# EAGLE design spectrometer-teensy-mk-1.0.0 (EAGLE 6.6.0)
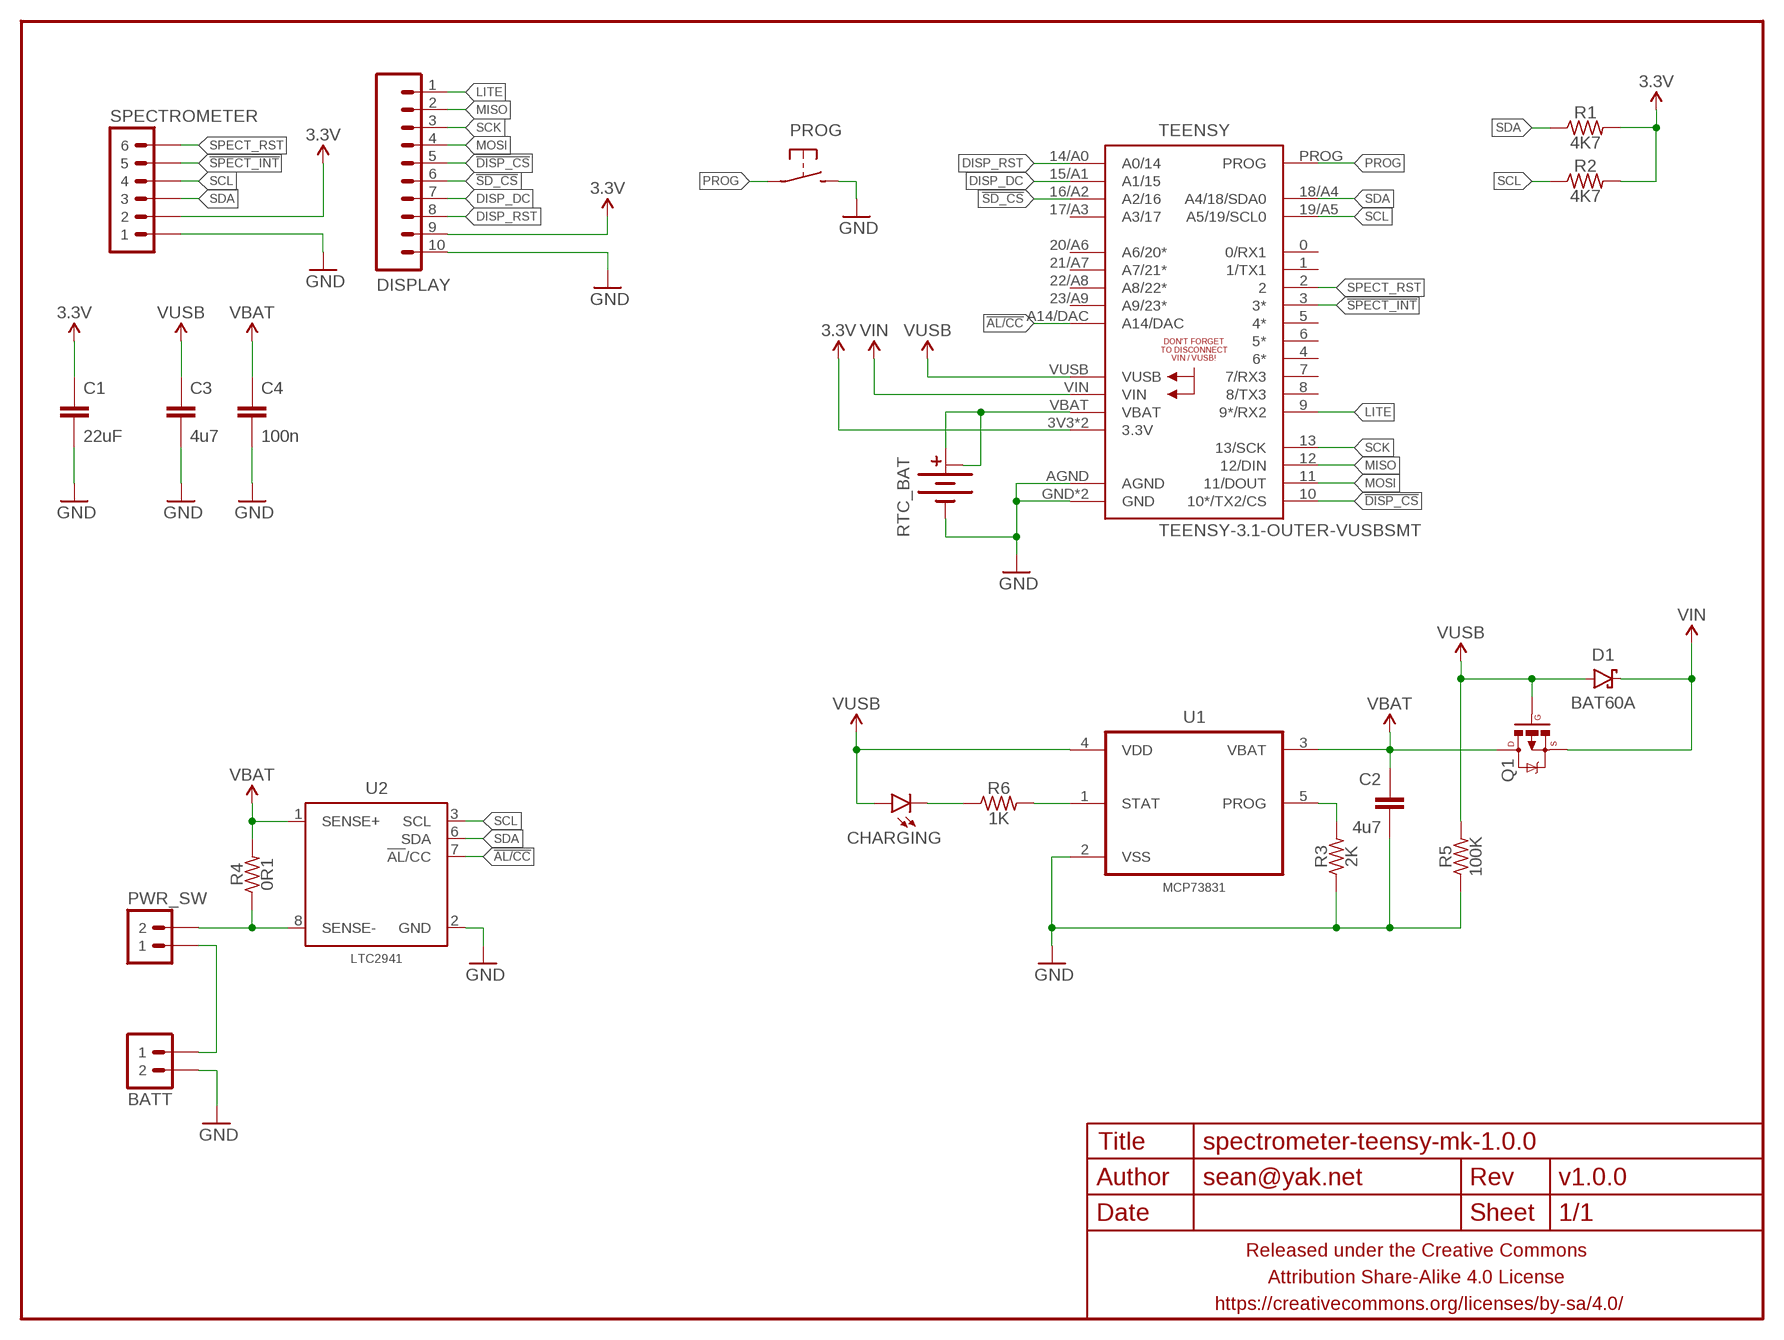
[diagram p0: schematic, sheet 1]

## Parts
BATT  M02JST-2MM-SMT  [JST-2-SMD]
C1  22uF  CAPACITOR-CERAMICC0805-TIGHTER  [C0805-TIGHTER]
C2  4u7  CAPACITOR-CERAMICC0603-TIGHTER  [C0603-TIGHTER]
C3  4u7  CAPACITOR-CERAMICC0603-TIGHTER  [C0603-TIGHTER]
C4  100n  CAPACITOR-CERAMICC0603-TIGHTER  [C0603-TIGHTER]
CHARGING  LED0603-TIGHT  [LED-0603-TIGHT]
D1  BAT60A  DIODE-SCHOTTKYSOD123  [SOD123-SCHOTTKY]
DISPLAY  M10SMD_RA_2MM  [1X10_SMD_RA_MALE]
FRAME1  FRAME-LETTERNO_PACKAGE  [DUMMY]
PROG  SPST-NO-TACTCK-PTS840-GK  [TACTILE-SMD-CK-PTS840-GK]
PWR_SW  M02JST-2MM-SMT  [JST-2-SMD]
Q1  MOSFET-PCHANNELSOT-23  [SOT23]
R1  4K7  RESISTORR0603-TIGHTER  [R0603-TIGHTER]
R2  4K7  RESISTORR0603-TIGHTER  [R0603-TIGHTER]
R3  2K  RESISTORR0603-TIGHTER  [R0603-TIGHTER]
R4  0R1  RESISTORR0603-TIGHTER  [R0603-TIGHTER]
R5  100K  RESISTORR0603-TIGHTER  [R0603-TIGHTER]
R6  1K  RESISTORR0603-TIGHTER  [R0603-TIGHTER]
RTC_BAT  BATTERY-COINCR1225_SMD_SMALLER  [BATTCON_12MM_SMD]
SPECTROMETER  M06SMD-2MM-RA  [1X06_SMD_RA_2MM]
TEENSY  TEENSY-3.1-OUTER-VUSBSMT  [TEENSY-3.1_SMT_BOTTOM_OUTERMOSTLY_VUSB]
U1  MCP73831  MCP73831T-2ACI/OT  [SOT95P280X145-5N]
U2  LTC2941  LTC2941MSOP-8  [MSOP-8]

## Nets
3.3V: C1.1 DISPLAY.9 R1.2 R2.2 SPECTROMETER.2 TEENSY.3V3(3.3V) TEENSY.3V3@1(3.3V)
!AL/CC: TEENSY.A14/DAC U2.7(!AL!/CC)
!DISP_CS: DISPLAY.5 TEENSY.10(10*/TX2/CS)
!SD_CS: DISPLAY.6 TEENSY.16/A2(A2/16)
!SPECT_INT: SPECTROMETER.5 TEENSY.3(3*)
DISP_DC: DISPLAY.7 TEENSY.15/A1(A1/15)
DISP_RST: DISPLAY.8 TEENSY.14/A0(A0/14)
GND: BATT.1 C1.2 C2.2 C3.2 C4.2 DISPLAY.10 PROG.3 PROG.4 R3.1 R5.1 RTC_BAT.- SPECTROMETER.1 TEENSY.AGND TEENSY.GND TEENSY.GND@1(GND) U1.2(VSS) U2.2(GND)
LITE: DISPLAY.1 TEENSY.9(9*/RX2)
MISO: DISPLAY.2 TEENSY.12(12/DIN)
MOSI: DISPLAY.4 TEENSY.11(11/DOUT)
N$1: R6.2 U1.1(STAT)
N$2: CHARGING.C R6.1
N$3: BATT.2 PWR_SW.2
N$4: R3.2 U1.5(PROG)
N$5: PWR_SW.1 R4.1 U2.8(SENSE-)
N$7: RTC_BAT.+@1(+) RTC_BAT.+@2(+1) TEENSY.VBAT
PROG: PROG.1 PROG.2 TEENSY.PROG
SCK: DISPLAY.3 TEENSY.13(13/SCK)
SCL: R2.1 SPECTROMETER.4 TEENSY.19/A5(A5/19/SCL0) U2.3(SCL)
SDA: R1.1 SPECTROMETER.3 TEENSY.18/A4(A4/18/SDA0) U2.6(SDA)
SPECT_RST: SPECTROMETER.6 TEENSY.2
VBAT: C2.1 C4.1 Q1.3(D) R4.2 U1.3(VBAT) U2.1(SENSE+)
VIN: D1.C Q1.2(S) TEENSY.VIN
VUSB: C3.1 CHARGING.A D1.A Q1.1(G) R5.2 TEENSY.VUSB U1.4(VDD)
Unconnected: TEENSY.0(0/RX1) TEENSY.1(1/TX1) TEENSY.4(6*) TEENSY.5(4*) TEENSY.6(5*) TEENSY.7(7/RX3) TEENSY.8(8/TX3) TEENSY.17/A3(A3/17) TEENSY.20/A6(A6/20*) TEENSY.21/A7(A7/21*) TEENSY.22/A8(A8/22*) TEENSY.23/A9(A9/23*)

## Library data of the parts
BATT PWR_SW = a_parts:M02: Standard 2-pin 0.1" header. Use with - straight break away headers ( PRT-00116) - right angle break away headers (PRT-00553) - swiss pins (PRT-00743) - machine pins (PRT-00117) - female headers (PRT-00115) Molex polarized connector foot print use with: PRT-08233 with associated crimp pins and housings. 2.54_SCREWTERM for use with PRT-10571. 3.5mm Screw Terminal footprints for PRT-08084 5mm Screw Terminal footprints for use with PRT-08433; PROD_ID: CONN-08352
C1-C4 = a_parts:CAPACITOR-CERAMIC: CAPACITOR, European symbol
CHARGING = a_parts:LED: LEDs Standard schematic elements and footprints for 5mm, 3mm, 1206, and 0603 sized LEDs. 5mm - Spark Fun Electronics SKU : COM-00529 (and others)
D1 = a_parts:DIODE-SCHOTTKY: Schottky diodes in SFE's production catalog BAT20J 1A 23V 0.62Vf RB751 120mA 40V 0.37Vf PMEG4005EJ 0.5A 40V 0.42Vf MBRA140 1A 40V 0.5Vf B340A 3A 40V SMA
DISPLAY = a_parts:M10: Header 10 Standard 10-pin 0.1" header. Use with straight break away headers (SKU : PRT-00116), right angle break away headers (PRT-00553), swiss pins (PRT-00743), machine pins (PRT-00117), and female headers (PRT-00115).
FRAME1 = a_parts:FRAME-LETTER: Schematic Frame Standard 8.5x11 US Letter frame; DESIGNER: sean@yak.net; VERSION: v1.0.0
PROG = a_parts:SPST-NO-TACT
Q1 = a_parts:MOSFET-PCHANNEL: Generic PMOSFET IRLML2244 - TRANS-11153 (SOT-23 -20V -4.3A) (1.Gate 2.Source 3.Drain) FQP27P06 - COM-10349 <http://www.sparkfun.com/products/10349> (TO-220 -60V -27A) (1.Gate 2.Source 3.Drain)
R1-R6 = a_parts:RESISTOR: RESISTOR, American symbol
RTC_BAT = a_parts:BATTERY-COIN
SPECTROMETER = a_parts:M06: Header 6 Standard 6-pin 0.1" header. Use with straight break away headers (SKU : PRT-00116), right angle break away headers (PRT-00553), swiss pins (PRT-00743), machine pins (PRT-00117), and female headers (PRT-00115). Molex polarized connector foot print use with SKU : PRT-08094 with associated crimp pins and housings. NOTES ON THE VARIANTS LOCK and LOCK_LONGPADS... This footprint was designed to help hold the alignment of a through-hole component (i.e. 6-pin header) while soldering it into place. You may notice that each hole has been shifted either up or down by 0.005 of an inch from it's more standard position (which is a perfectly straight line). This slight alteration caused the pins (the squares in the middle) to touch the edges of the holes. Because they are alternating, it causes a "brace" to hold the component in place. 0.005 has proven to be the perfect amount of "off-center" position when using our standard breakaway headers. Although looks a little odd when you look at the bare footprint, once you have a header in there, the alteration is very hard to notice. Also,if you push a header all the way into place, it is covered up entirely on the bottom side. This idea of altering the position of holes to aid alignment will be further integrated into the Sparkfun Library for other footprints. It can help hold any component with 3 or more connection pins.
TEENSY = a_parts:TEENSY-3.1-OUTER-VUSB
U1 = a_parts:MCP73831T-2ACI/OT: Charge Management Controller; MPN: MCP73831T-2ACI/OT; OC_FARNELL: 1332158; OC_NEWARK: 56K7045; PACKAGE: SOT-5; SUPPLIER: Microchip
U2 = a_parts:LTC2941

## Board
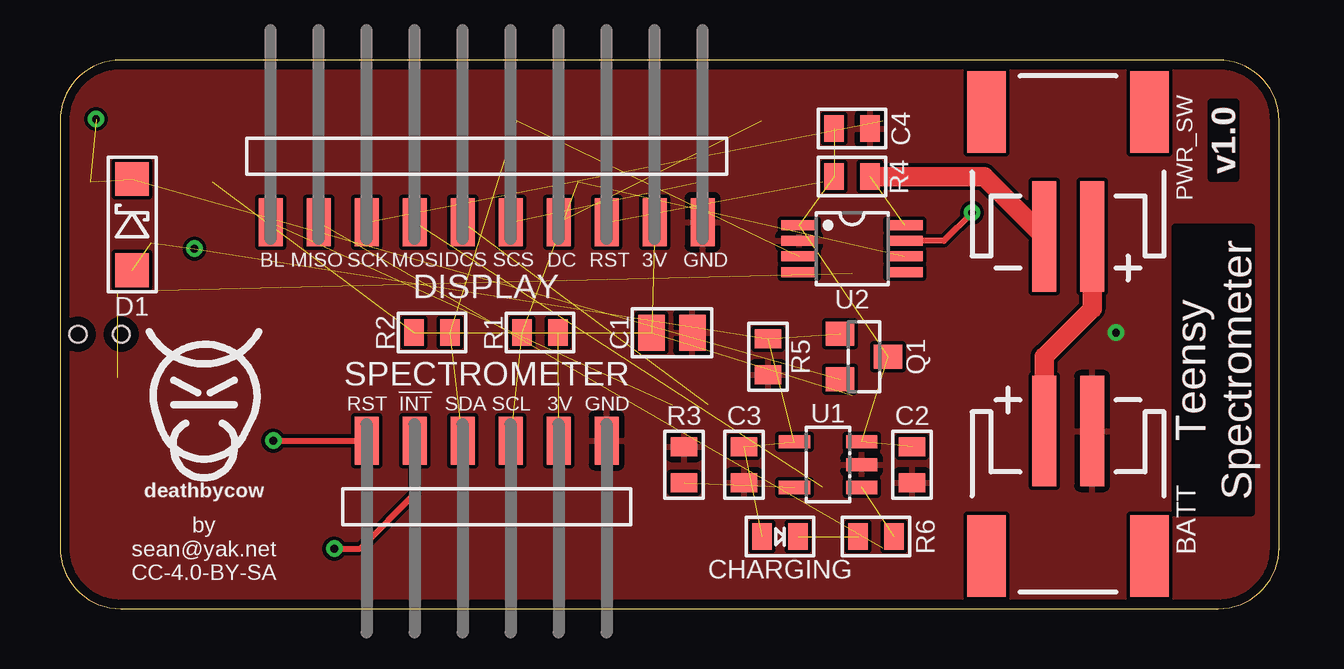
[diagram p1: board, top side]
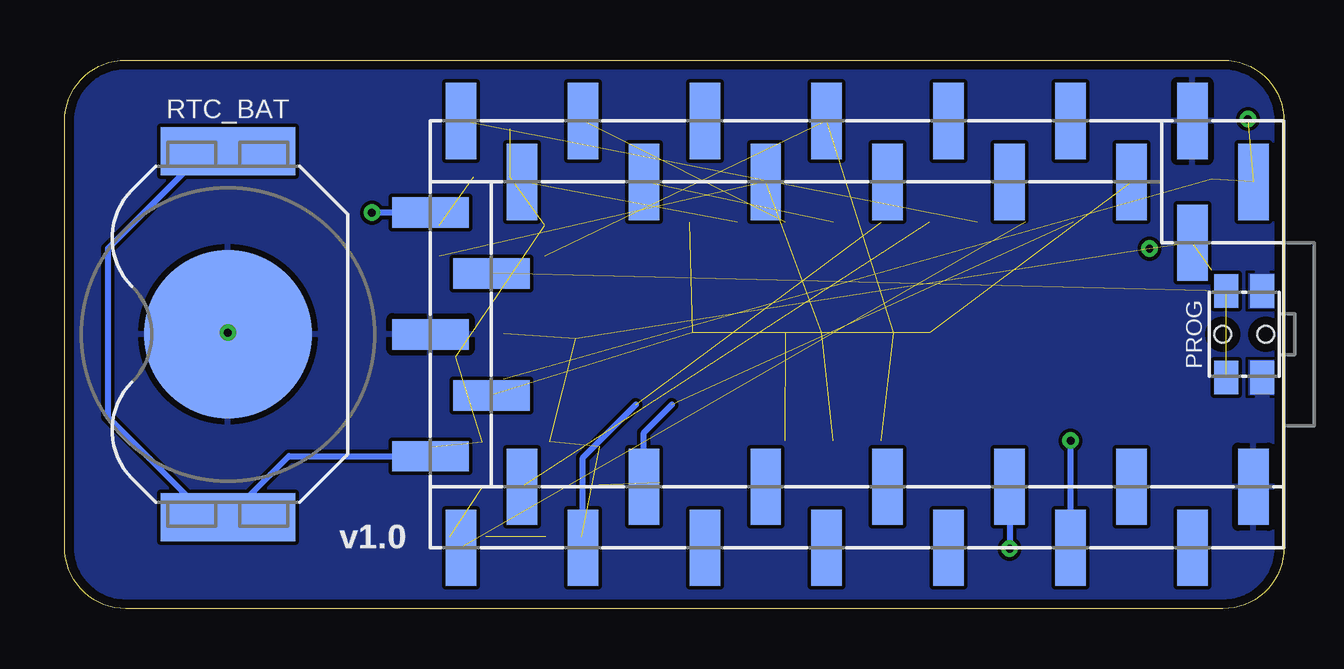
[diagram p2: board, bottom side, seen from below]

Size 50.8 x 22.86 mm. Coordinates in mm from the lower left corner, seen from the top.
Outline: 48.26,22.86 2.54,22.86 arc90 0,20.32 0,2.54 arc90 2.54,0 48.26,0 arc90 50.8,2.54 50.8,20.32 arc90 48.26,22.86
Copper layers (1*16): Top 0.0356mm / dielectric 1.5011mm / Bottom 0.0356mm
Design rules "LaenPCBOrder2": minimum track width 6mil, minimum drill 13mil, track to track 6mil, track to pad 6mil, pad to pad 6mil, via to via 6mil, smd to smd 6mil, copper to edge 15mil, drill to drill 6mil, minimum pad ring 7mil, minimum via ring 7mil, stop-mask expansion 3mil, vias tented up to drill 20mil, thermal gap 10mil

### Footprints (pad centres in the part's own frame; a part is rotated, then mirrored left to right if it is on the bottom)
JST-2-SMD = smd 1 x 4.6: 1 -1,-3.7; 2 1,-3.7 | smd 1.6 x 3.4: NC1 -3.4,1.5; NC2 3.4,1.5
C0805-TIGHTER = smd 1.1 x 1.5: 1 -0.85,0; 2 0.85,0
C0603-TIGHTER = smd 0.8 x 1.1: 1 -0.75,0; 2 0.75,0
LED-0603-TIGHT = smd 0.8 x 1.1: A 0.75,0; C -0.75,0
SOD123-SCHOTTKY = smd 1.4 x 1.4: A -1.9,0; C 1.9,0
1X10_SMD_RA_MALE = smd 1 x 2: 1 -9,0; 2 -7,0; 3 -5,0; 4 -3,0; 5 -1,0; 6 1,0; 7 3,0; 8 5,0; 9 7,0; 10 9,0
TACTILE-SMD-CK-PTS840-GK = smd 1.4 x 1: 1 -1.8,0.75; 2 1.8,0.75; 3 -1.8,-0.75; 4 1.8,-0.75 | hole 0.7: 0,-0.9; 0,0.9
SOT23 = smd 1 x 1.2: 1 -0.95,-1; 2 0.95,-1; 3 0,1
R0603-TIGHTER = smd 0.8 x 1.1: 1 -0.75,0; 2 0.75,0
BATTCON_12MM_SMD = smd 2 x 5.6: +@1 -7.62,0; +@2 7.62,0 | smd 7 x 7: - 0,0
1X06_SMD_RA_2MM = smd 1 x 2: 1 -5,0; 2 -3,0; 3 -1,0; 4 1,0; 5 3,0; 6 5,0
TEENSY-3.1_SMT_BOTTOM_OUTERMOSTLY_VUSB = smd 3.175 x 1.27 bottom: 0 8.89,-13.97; 1 6.35,-11.43; 2 8.89,-8.89; 3 6.35,-6.35; 3V3@1 -6.35,-11.43; 4 8.89,-3.81; 5 6.35,-1.27; 6 8.89,1.27; 7 6.35,3.81; 8 8.89,6.35; 9 6.35,8.89; 10 8.89,11.43; 11 6.35,13.97; 12 8.89,16.51; 13 -8.89,16.51; 14/A0 -6.35,13.97; 15/A1 -8.89,11.43; 16/A2 -6.35,8.89; 17/A3 -8.89,6.35; 18/A4 -6.35,3.81; 19/A5 -8.89,1.27; 20/A6 -6.35,-1.27; 21/A7 -8.89,-3.81; 22/A8 -6.35,-6.35; 23/A9 -8.89,-8.89; AGND -8.89,-13.97; GND 6.35,-16.51; VIN -6.35,-16.51; VUSB -3.81,-13.97 | smd 1.27 x 3.175 bottom: 3V3 2.54,15.24; A14/DAC -5.08,17.78; GND@1 0,17.78; PROG -2.54,15.24; VBAT 5.08,17.78
SOT95P280X145-5N = smd 1.3 x 0.55: 1 -1.4,0.95; 2 -1.4,0; 3 -1.4,-0.95; 4 1.4,-0.95; 5 1.4,0.95
MSOP-8 = smd 1.5 x 0.42: 1 -2.2,0.975; 2 -2.2,0.325; 3 -2.2,-0.325; 4 -2.2,-0.975; 5 2.2,-0.975; 6 2.2,-0.325; 7 2.2,0.325; 8 2.2,0.975

### Placement (x,y rotation side)
BATT  42,3.7 180 top
C1  25.5,11.5 0 top
C2  35.5,6 270 top
C3  28.5,6 270 top
C4  33,20 0 top
CHARGING  30,3 180 top
D1  3,16 90 top
DISPLAY  17.78,16.11 0 top
FRAME1  0,0 0 top
PROG  1.65,11.43 90 bottom
PWR_SW  42,19.2 0 top
Q1  33.5,10.5 270 top
R1  20,11.5 0 top
R2  15.5,11.5 180 top
R3  26,6 270 top
R4  33,18 180 top
R5  29.5,10.5 90 top
R6  34,3 0 top
RTC_BAT  44,11.43 270 bottom
SPECTROMETER  17.78,7 180 top
TEENSY  17.78,11.43 270 top
U1  32,6 180 top
U2  33,15 0 top
U$1  [COW_SMALL]  6,9 0 top

### Tracks (layer width: path | path; a pad name or v marks a point on that pad's centre or on a via)
3.3V  (6 unrouted)
!AL/CC  (via drill 0.33)
  Top 0.254: v38,16.5 36.83,15.32 U2.7
  Bottom 0.254: TEENSY.A14/DAC v38,16.5
!DISP_CS  (1 unrouted)
  Bottom 0.254: TEENSY.10 29.21,6.29 27,8.5
!SD_CS  (1 unrouted)
!SPECT_INT  (via drill 0.33)
  Top 0.254: v11.43,2.5 12.5,2.5 14.78,4.78 SPECTROMETER.5
  Bottom 0.254: TEENSY.3 v11.43,2.5
DISP_DC  (1 unrouted)
DISP_RST  (1 unrouted)
GND  (via drill 0.33)
  other vias: 44,11.5
  pour Bottom: 48.26,22.86 2.54,22.86 arc90 0,20.32 0,2.54 arc90 2.54,0 48.26,0 arc90 50.8,2.54 50.8,20.32 arc90
  pour Top: 48.26,22.86 2.54,22.86 arc90 0,20.32 0,2.54 arc90 2.54,0 48.26,0 arc90 50.8,2.54 50.8,20.32 arc90
LITE  (1 unrouted)
  Bottom 0.254: TEENSY.9 26.67,7.33 25.5,8.5
MISO  (1 unrouted)
MOSI  (1 unrouted)
N$1  (1 unrouted)
N$2  (1 unrouted)
N$3
  Top 0.813: BATT.2 41,10.5 43,12.5 PWR_SW.2
N$4  (1 unrouted)
N$5  (1 unrouted)
  Top 0.813: PWR_SW.1 38.5,18 R4.1
N$7
  Bottom 0.254: RTC_BAT.+@1 44.95,19.05 49,15 49,8 44.81,3.81 RTC_BAT.+@2 41.46,6.35 TEENSY.VBAT
PROG  (2 unrouted)
SCK  (1 unrouted)
SCL  (3 unrouted)
SDA  (3 unrouted)
SPECT_RST  (via drill 0.33)
  Top 0.254: v8.89,7 SPECTROMETER.6
  Bottom 0.254: TEENSY.2 v8.89,7
VBAT  (5 unrouted)
VIN  (via drill 0.33)  (3 unrouted)
  other vias: 1.5,20.4
VUSB  (via drill 0.33)  (7 unrouted)
  other vias: 5.6,15

### Text on the board
Top: Teensy / Spectrometer
tPlace: BL | MISO | SCK | MOSI | DCS | SCS | DC | RST | 3V | GND | Teensy / Spectrometer | RST | !INT | SDA | SCL | 3V | GND | by / sean@yak.net / CC-4.0-BY-SA